# Altium schematic sheet harmonicAnalyzer.SchDoc
size A4
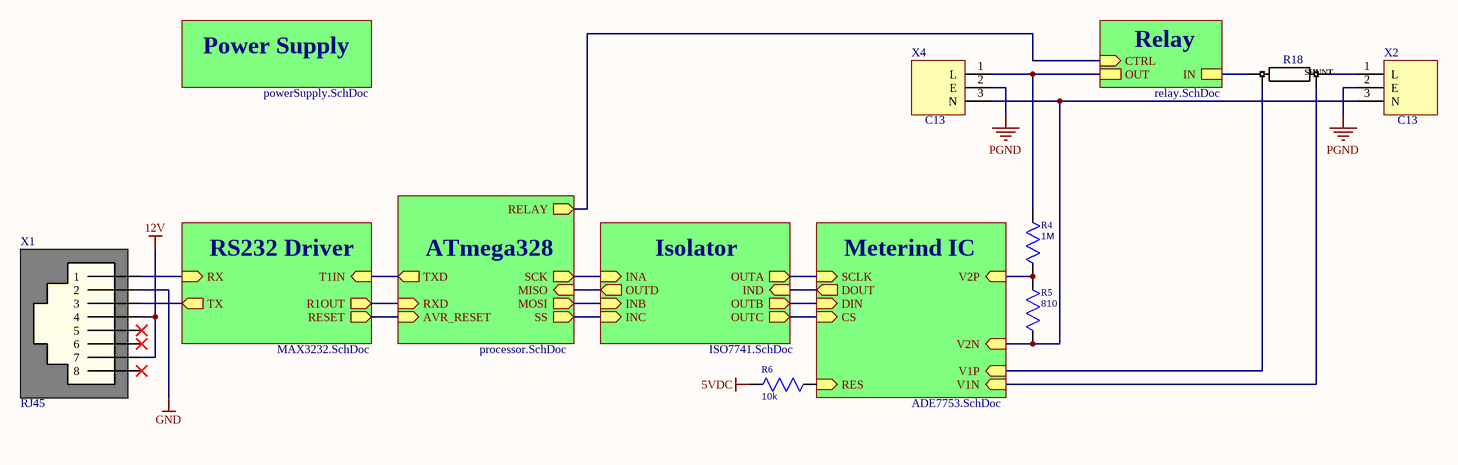
[diagram p0: harmonicAnalyzer.SchDoc]

## Parts
R4  1M  [R_0805]
R5  810  [R_0805]
R6  10k  [R_0603]
R18  SHUNT  [WSHP2818]  (value not drawn)
X1  RJ45  [RJ45]
X2  C13  [C13_RA_TH]
X4  C13  [C13_RA_TH]

## Sub-sheets
ATmega328 = processor.SchDoc: MOSI (out), SS (out), MISO (in), RXD (in), SCK (out), TXD (out), AVR_RESET (in), RELAY (out)
Isolator = ISO7741.SchDoc: OUTC (out), IND (in), INC (in), OUTD (out), INA (in), OUTB (out), OUTA (out), INB (in)
Meterind IC = ADE7753.SchDoc: DOUT (out), CS (in), V2N (in), V2P (in), DIN (in), RES (in), SCLK (in), V1N (in), V1P (in)
Power Supply = powerSupply.SchDoc: no entries
Relay = relay.SchDoc: CTRL (in), OUT, IN
RS232 Driver = MAX3232.SchDoc: T1IN (in), RX (in), TX (out), R1OUT (out), RESET (out)

## Nets
5VDC: R6.1
12V: X1.4 X1.7
GND: X1.2
PGND: X2.2(E) X4.2(E)
NetR4_1: R4.1 X4.1(L) ; sheet Relay/OUT
NetR4_2: R4.2 R5.1 ; sheet Meterind IC/V2P
NetR5_2: R5.2 X2.3(N) X4.3(N) ; sheet Meterind IC/V2N
NetR6_2: R6.2 ; sheet Meterind IC/RES
NetR18_1: R18.1 X2.1(L)
NetR18_2: R18.2 ; sheet Relay/IN
NetR18_3: R18.3 ; sheet Meterind IC/V1N
NetR18_4: R18.4 ; sheet Meterind IC/V1P
NetX1_1: X1.1 ; sheet RS232 Driver/RX
NetX1_3: X1.3 ; sheet RS232 Driver/TX
(unnamed): sheet RS232 Driver/T1IN, sheet ATmega328/TXD
(unnamed): sheet RS232 Driver/R1OUT, sheet ATmega328/RXD
(unnamed): sheet RS232 Driver/RESET, sheet ATmega328/AVR_RESET
(unnamed): sheet ATmega328/MOSI, sheet Isolator/INB
(unnamed): sheet ATmega328/SS, sheet Isolator/INC
(unnamed): sheet ATmega328/MISO, sheet Isolator/OUTD
(unnamed): sheet ATmega328/SCK, sheet Isolator/INA
(unnamed): sheet ATmega328/RELAY, sheet Relay/CTRL
(unnamed): sheet Isolator/OUTC, sheet Meterind IC/CS
(unnamed): sheet Isolator/IND, sheet Meterind IC/DOUT
(unnamed): sheet Isolator/OUTB, sheet Meterind IC/DIN
(unnamed): sheet Isolator/OUTA, sheet Meterind IC/SCLK

Not connected (* = marked no-connect by the designer): X1 5* 6* 8*

## Library data of the parts
R4 R5 = R0805: Resistor
  R4: Value: 1M
  R5: Value: 810
R6 = R0603: Resistor; Value: 10k
R18 = SHUNT: Current Shunt; Link: https://www.digikey.com/product-detail/en/vishay-dale/WSHP2818R0330FEA/541-3279-1-ND/6605255
X1 = RJ45: Outlet YH-55-05 8P8C 5521; Link: https://www.rcscomponents.kiev.ua/product/rozetka-yh-55-05-8p8c-5521-l-kls12-133-8p8c-w-o-2-01_8324.html